# Altium schematic sheet CarMainBoard.SchDoc
size A2
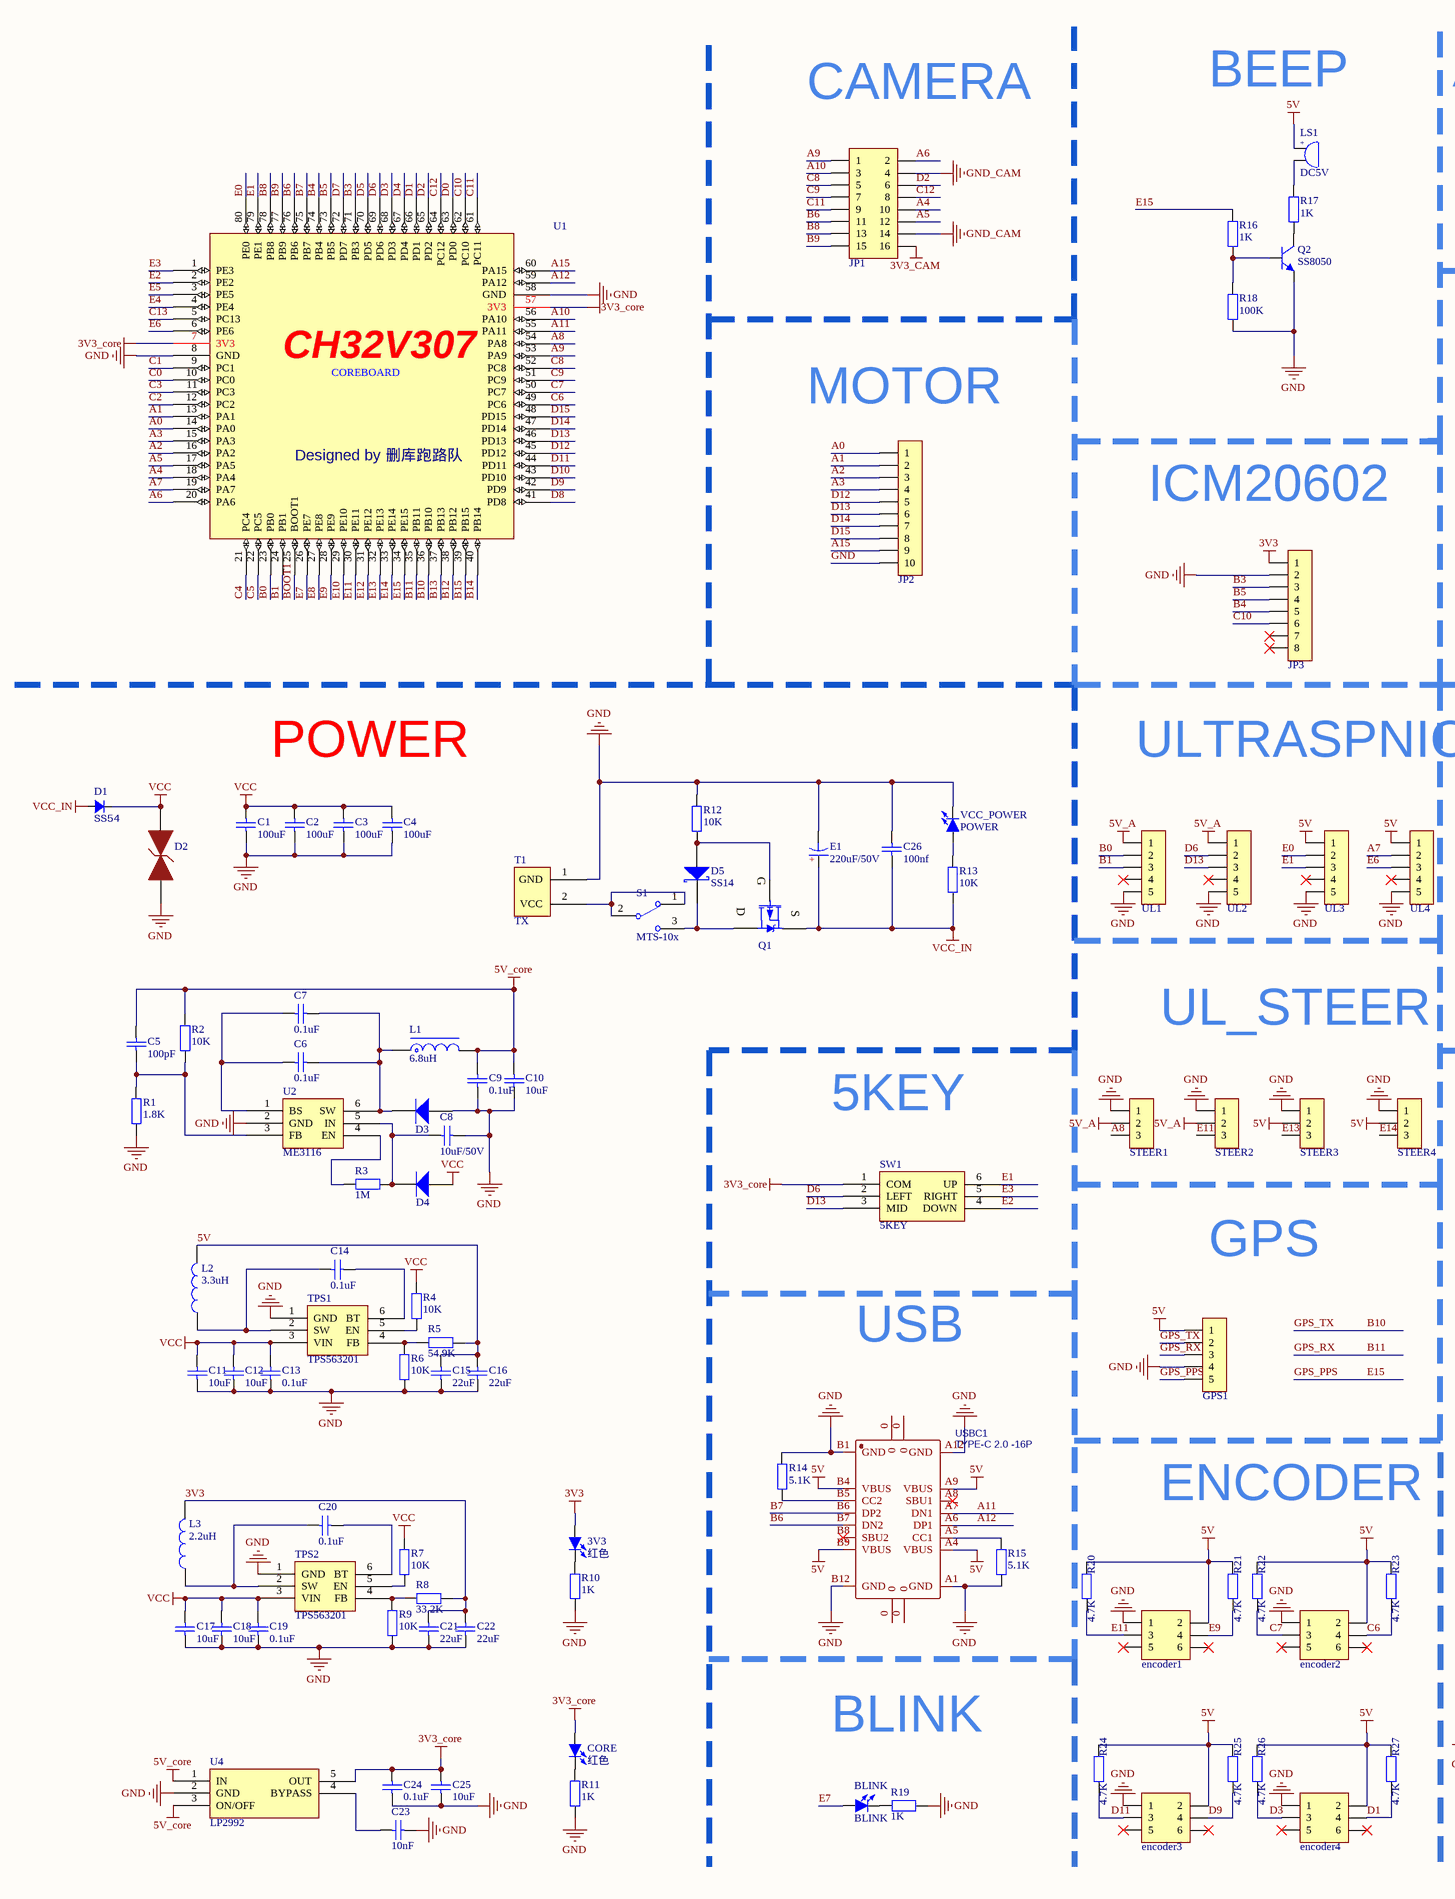
[diagram p0: CarMainBoard.SchDoc, left]
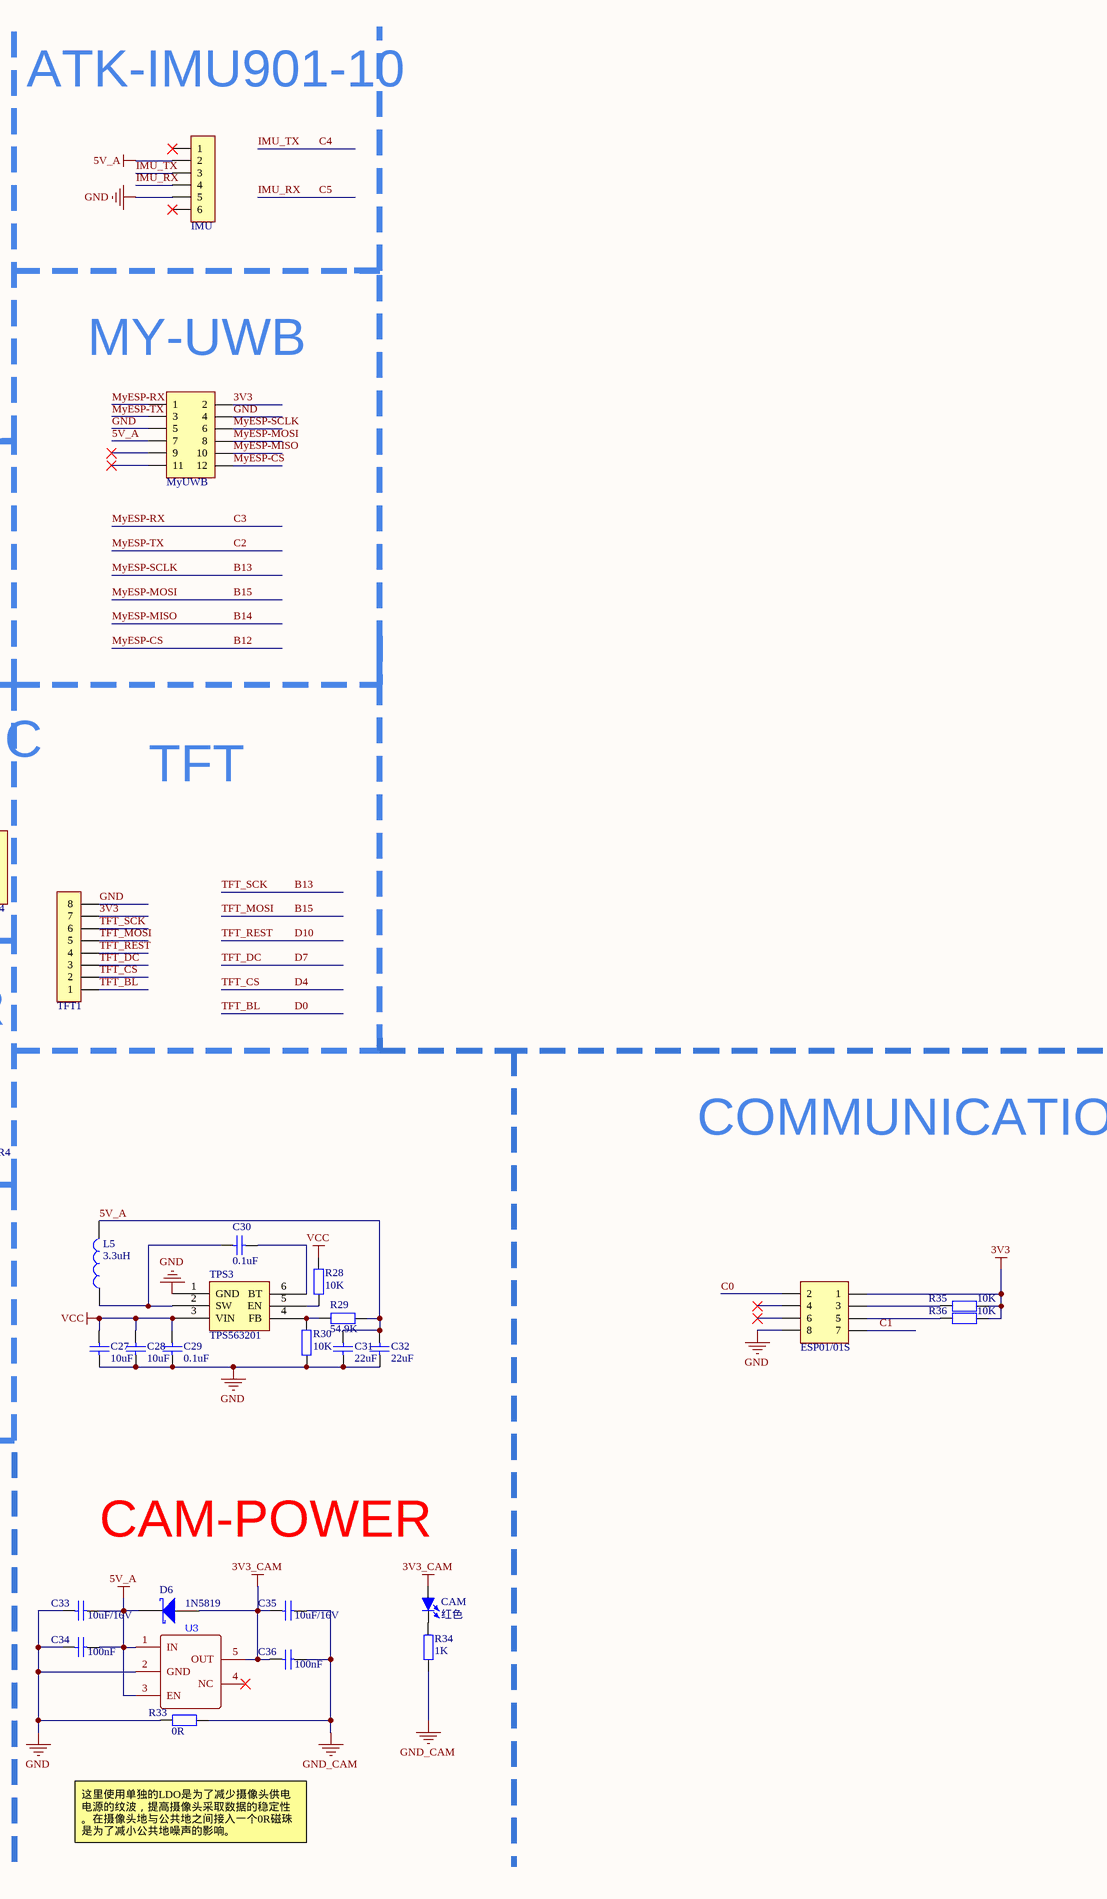
[diagram p1: CarMainBoard.SchDoc, right]

## Parts
3V3  红色  [LED0805_G]
BLINK  BLINK  [LED0805_G]
C1  100uF  [C1206_L]
C2  100uF  [C1206_L]
C3  100uF  [C1206_L]
C4  100uF  [C1206_L]
C5  100pF  [C0402_L]
C6  0.1uF  [C0402_L]
C7  0.1uF  [C0402_L]
C8  10uF/50V  [C0603_L]
C9  0.1uF  [C0402_L]
C10  10uF  [C0402_L]
C11  10uF  [C0805_L]
C12  10uF  [C0805_L]
C13  0.1uF  [C0805_L]
C14  0.1uF  [C0805_L]
C15  22uF  [C0805_L]
C16  22uF  [C0805_L]
C17  10uF  [C0805_L]
C18  10uF  [C0805_L]
C19  0.1uF  [C0805_L]
C20  0.1uF  [C0805_L]
C21  22uF  [C0805_L]
C22  22uF  [C0805_L]
C23  10nF  [C0402_L]
C24  0.1uF  [C0402_L]
C25  10uF  [C0402_L]
C26  100nf  [C0805_L]
C27  10uF  [C0805_L]
C28  10uF  [C0805_L]
C29  0.1uF  [C0805_L]
C30  0.1uF  [C0805_L]
C31  22uF  [C0805_L]
C32  22uF  [C0805_L]
C33  10uF/16V  [C0805_L]
C34  100nF  [C0805_L]
C35  10uF/16V  [C0805_L]
C36  100nF  [C0805_L]
CAM  红色  [LED0805_G]
CORE  红色  [LED0805_G]
D1  SS54  [SMA]
D2  SMBJ28CA  [SMB]  (value not drawn)
D3  二极管-5819W  [SOD-323]  (value not drawn)
D4  二极管-5819W  [SOD-323]  (value not drawn)
D5  SS14  [SMA]
D6  1N5819  [SOD-323]
E1  220uF/50V  [CE F(10*10.2)]
encoder1  Header3X2  [HDR2.54-M-LS-2x3P]  (value not drawn)
encoder2  Header3X2  [HDR2.54-M-LS-2x3P]  (value not drawn)
encoder3  Header3X2  [HDR2.54-M-LS-2x3P]  (value not drawn)
encoder4  Header3X2  [HDR2.54-M-LS-2x3P]  (value not drawn)
ESP01/01S  Header 4X2  [HDR2.54-M-LS-2x4P]  (value not drawn)
GPS1  HDR-1X5  [HDR2.54-M-LI-5P]  (value not drawn)
IMU  HDR-1X6  [HDR2.54-M-LI-6P]  (value not drawn)
JP1  Header 8X2  [HDR2.54-M-LS-2x8P]  (value not drawn)
JP2  HDR-1X10  [XH2.54-LI-10P]  (value not drawn)
JP3  HDR-1X8  [HDR2.54-M-LI-8P]  (value not drawn)
L1  6.8uH  [L-SMD-0420]
L2  3.3uH  [L-SMD-0630]
L3  2.2uH  [L-SMD-0630]
L5  3.3uH  [L-SMD-0630]
LS1  DC5V  [BEEP 5x9x5.5]
MyUWB  Header 6X2  [HDR2.54-M-LS-2x6P]  (value not drawn)
Q1  D15P05  [TO252]  (value not drawn)
Q2  SS8050  [SOT23-3N]
R1  1.8K  [R0402_L]
R2  10K  [R0402_L]
R3  1M  [R0402_L]
R4  10K  [R0603_L]
R5  54.9K  [R0603_L]
R6  10K  [R0603_L]
R7  10K  [R0603_L]
R8  33.2K  [R0603_L]
R9  10K  [R0603_L]
R10  1K  [R0402_L]
R11  1K  [R0402_L]
R12  10K  [R0805_L]
R13  10K  [R0805_L]
R14  5.1K  [R0402_L]
R15  5.1K  [R0402_L]
R16  1K  [R0402_L]
R17  1K  [R0402_L]
R18  100K  [R0402_L]
R19  1K  [R0402_L]
R20  4.7K  [R0603_L]
R21  4.7K  [R0603_L]
R22  4.7K  [R0603_L]
R23  4.7K  [R0603_L]
R24  4.7K  [R0603_L]
R25  4.7K  [R0603_L]
R26  4.7K  [R0603_L]
R27  4.7K  [R0603_L]
R28  10K  [R0603_L]
R29  54.9K  [R0603_L]
R30  10K  [R0603_L]
R33  0R  [R0805_L]
R34  1K  [R0402_L]
R35  10K  [R0402_L]
R36  10K  [R0402_L]
S1  MTS-10x  [MTS-10x]
STEER1  HDR-1X3  [HDR2.54-LI-3P]  (value not drawn)
STEER2  HDR-1X3  [HDR2.54-LI-3P]  (value not drawn)
STEER3  HDR-1X3  [HDR2.54-LI-3P]  (value not drawn)
STEER4  HDR-1X3  [HDR2.54-LI-3P]  (value not drawn)
SW1  5KEY  [SW 10x10x9-5Key-LS]
T1  TX  [T接头]
TFT1  HDR-1X8  [HDR2.54-M-LI-8P]  (value not drawn)
TPS1  TPS563201  [SOT23-6N]
TPS2  TPS563201  [SOT23-6N]
TPS3  TPS563201  [SOT23-6N]
U1  CH32V307_CoreBoard  [CH32V307_PCB]  (value not drawn)
U2  ME3116  [SOT23-6]
U3  (no value)  [SOT23-5]
U4  LP2992  [SOT23-5]
UL1  HDR-1X5  [HDR2.54-M-LI-5P]  (value not drawn)
UL2  HDR-1X5  [HDR2.54-M-LI-5P]  (value not drawn)
UL3  HDR-1X5  [HDR2.54-M-LI-5P]  (value not drawn)
UL4  HDR-1X5  [HDR2.54-M-LI-5P]  (value not drawn)
USBC1  TYPE-C 2.0 -16P  [USB-C-SMD_TYPE-C-USB-5]
VCC_POWER  POWER  [LED 0805R]

## Nets
3V3: 3V3.1(A) C21.1 C22.1 ESP01/01S.1 JP3.1 L3.2 MyUWB.2 R8.1 R35.1 R36.1 TFT1.7
3V3_CAM: C35.2 C36.2 CAM.1(A) D6.1(A) JP1.16 U3.5(OUT)
3V3_core: C24.2 C25.2 CORE.1(A) SW1.1(COM) U1.7(3V3) U1.57(3V3) U4.5(OUT)
5V: C15.1 C16.1 encoder1.2 encoder2.2 encoder3.2 encoder4.2 GPS1.1 L2.2 LS1.1 R5.1 R20.2 R21.2 R22.2 R23.2 R24.2 R25.2 R26.2 R27.2 STEER3.2 STEER4.2 UL3.1 UL4.1 USBC1.A4(VBUS) USBC1.A9(VBUS) USBC1.B4(VBUS) USBC1.B9(VBUS)
5V_A: C31.1 C32.1 C33.1 C34.1 D6.2(K) IMU.2 L5.2 MyUWB.7 R29.1 STEER1.2 STEER2.2 U3.1(IN) U3.3(EN) UL1.1 UL2.1
5V_core: C5.2 C9.1 C10.2 L1.2 R2.2 U4.1(IN) U4.3(ON/OFF)
GND: C1.1 C2.1 C3.1 C4.1 C8.1 C9.2 C10.1 C11.1 C12.1 C13.1 C15.2 C16.2 C17.1 C18.1 C19.1 C21.2 C22.2 C23.1 C24.1 C25.1 C26.2 C27.1 C28.1 C29.1 C31.2 C32.2 C33.2 C34.2 D2.1 D3.1(A) E1.2 encoder1.1 encoder2.1 encoder3.1 encoder4.1 ESP01/01S.8 GPS1.4 IMU.5 JP2.10 JP3.2 MyUWB.4 MyUWB.5 Q2.2(E) R1.1 R6.1 R9.1 R10.1 R11.1 R12.2 R14.2 R15.1 R18.1 R19.2 R30.1 R33.1 STEER1.1 STEER2.1 STEER3.1 STEER4.1 T1.1(GND) TFT1.8 TPS1.1(GND) TPS2.1(GND) TPS3.1(GND) U1.8(GND) U1.58(GND) U2.2(GND) U3.2(GND) U4.2(GND) UL1.5 UL2.5 UL3.5 UL4.5 USBC1.A1(GND) USBC1.A12(GND) USBC1.B1(GND) USBC1.B12(GND) VCC_POWER.2(K)
GND_CAM: C35.1 C36.1 JP1.4 JP1.14 R33.2 R34.1
VCC: C1.2 C2.2 C3.2 C4.2 C11.2 C12.2 C13.2 C17.2 C18.2 C19.2 C27.2 C28.2 C29.2 D1.2(K) D2.2 D4.1(A) R4.2 R7.2 R28.2 TPS1.3(VIN) TPS2.3(VIN) TPS3.3(VIN)
VCC_IN: C26.1 D1.1(A) E1.1 Q1.3(S) R13.1
A0: JP2.1 U1.14(PA0)
A1: JP2.2 U1.13(PA1)
A2: JP2.3 U1.16(PA2)
A3: JP2.4 U1.15(PA3)
A4: JP1.10 U1.18(PA4)
A5: JP1.12 U1.17(PA5)
A6: JP1.2 U1.20(PA6)
A7: U1.19(PA7) UL4.2
A8: STEER1.3 U1.54(PA8)
A9: JP1.1 U1.53(PA9)
A10: JP1.3 U1.56(PA10)
A11: U1.55(PA11) USBC1.A7(DN1)
A12: U1.59(PA12) USBC1.A6(DP1)
A15: JP2.9 U1.60(PA15)
B0: U1.23(PB0) UL1.2
B1: U1.24(PB1) UL1.3
B3: JP3.3 U1.71(PB3)
B4: JP3.5 U1.74(PB4)
B5: JP3.4 U1.73(PB5)
B6: JP1.11 U1.76(PB6) USBC1.B7(DN2)
B7: U1.75(PB7) USBC1.B6(DP2)
B8: JP1.13 U1.78(PB8)
B9: JP1.15 U1.77(PB9)
B10: GPS1.2 U1.36(PB10)  [also labelled GPS_TX]
B11: GPS1.3 U1.35(PB11)  [also labelled GPS_RX]
B12: MyUWB.12 U1.38(PB12)  [also labelled MyESP-CS]
B13: MyUWB.6 TFT1.6 U1.37(PB13)  [also labelled MyESP-SCLK, TFT_SCK]
B14: MyUWB.10 U1.40(PB14)  [also labelled MyESP-MISO]
B15: MyUWB.8 TFT1.5 U1.39(PB15)  [also labelled MyESP-MOSI, TFT_MOSI]
BOOT1: U1.25(BOOT1)
C0: ESP01/01S.2 U1.10(PC0)
C1: ESP01/01S.7 U1.9(PC1)
C2: MyUWB.3 U1.12(PC2)  [also labelled MyESP-TX]
C3: MyUWB.1 U1.11(PC3)  [also labelled MyESP-RX]
C4: IMU.3 U1.21(PC4)  [also labelled IMU_TX]
C5: IMU.4 U1.22(PC5)  [also labelled IMU_RX]
C6: encoder2.4 R23.1 U1.49(PC6)
C7: encoder2.3 R22.1 U1.50(PC7)
C8: JP1.5 U1.52(PC8)
C9: JP1.7 U1.51(PC9)
C10: JP3.6 U1.62(PC10)
C11: JP1.9 U1.61(PC11)
C12: JP1.8 U1.64(PC12)
C13: U1.5(PC13)
D0: TFT1.1 U1.63(PD0)  [also labelled TFT_BL]
D1: encoder4.4 R27.1 U1.66(PD1)
D2: JP1.6 U1.65(PD2)
D3: encoder4.3 R26.1 U1.68(PD3)
D4: TFT1.2 U1.67(PD4)  [also labelled TFT_CS]
D5: U1.70(PD5)
D6: SW1.2(LEFT) U1.69(PD6) UL2.2
D7: TFT1.3 U1.72(PD7)  [also labelled TFT_DC]
D8: U1.41(PD8)
D9: encoder3.4 R25.1 U1.42(PD9)
D10: TFT1.4 U1.43(PD10)  [also labelled TFT_REST]
D11: encoder3.3 R24.1 U1.44(PD11)
D12: JP2.5 U1.45(PD12)
D13: JP2.6 SW1.3(MID) U1.46(PD13) UL2.3
D14: JP2.7 U1.47(PD14)
D15: JP2.8 U1.48(PD15)
E0: U1.80(PE0) UL3.2
E1: SW1.6(UP) U1.79(PE1) UL3.3
E2: SW1.4(DOWN) U1.2(PE2)
E3: SW1.5(RIGHT) U1.1(PE3)
E4: U1.4(PE4)
E5: U1.3(PE5)
E6: U1.6(PE6) UL4.3
E7: BLINK.1(A) U1.26(PE7)
E8: U1.27(PE8)
E9: encoder1.4 R21.1 U1.28(PE9)
E10: U1.29(PE10)
E11: encoder1.3 R20.1 STEER2.3 U1.30(PE11)
E12: U1.31(PE12)
E13: STEER3.3 U1.32(PE13)
E14: STEER4.3 U1.33(PE14)
E15: GPS1.5 R16.1 U1.34(PE15)  [also labelled GPS_PPS]
Net3V3_2: 3V3.2(K) R10.2
NetBLINK_2: BLINK.2(K) R19.1
NetC5_1: C5.1 R1.2 R2.1 U2.3(FB)
NetC6_1: C6.1 C7.1 D3.2(K) L1.1 U2.6(SW)
NetC6_2: C6.2 C7.2 U2.1(BS)
NetC8_2: C8.2 D4.2(K) R3.2 U2.5(IN)
NetC14_1: C14.1 L2.1 TPS1.2(SW)
NetC14_2: C14.2 TPS1.6(BT)
NetC20_1: C20.1 L3.1 TPS2.2(SW)
NetC20_2: C20.2 TPS2.6(BT)
NetC23_2: C23.2 U4.4(BYPASS)
NetC30_1: C30.1 L5.1 TPS3.2(SW)
NetC30_2: C30.2 TPS3.6(BT)
NetCAM_2: CAM.2(K) R34.2
NetCORE_2: CORE.2(K) R11.2
NetD5_1: D5.1(A) Q1.1(G) R12.1
NetD5_2: D5.2(K) Q1.2(D) S1.3
NetESP01/01S_3: ESP01/01S.3 R35.2
NetESP01/01S_5: ESP01/01S.5 R36.2
NetLS1_2: LS1.2 R17.2
NetQ2_1: Q2.1(B) R16.2 R18.2
NetQ2_3: Q2.3(C) R17.1
NetR3_1: R3.1 U2.4(EN)
NetR4_1: R4.1 TPS1.5(EN)
NetR5_2: R5.2 R6.2 TPS1.4(FB)
NetR7_1: R7.1 TPS2.5(EN)
NetR8_2: R8.2 R9.2 TPS2.4(FB)
NetR13_2: R13.2 VCC_POWER.1(A)
NetR14_1: R14.1 USBC1.B5(CC2)
NetR15_2: R15.2 USBC1.A5(CC1)
NetR28_1: R28.1 TPS3.5(EN)
NetR29_2: R29.2 R30.2 TPS3.4(FB)
NetS1_1: S1.1 S1.2 T1.2(VCC)

Not connected (* = marked no-connect by the designer): encoder1 5* 6*; encoder2 5* 6*; encoder3 5* 6*; encoder4 5* 6*; ESP01/01S 4* 6*; IMU 1* 6*; JP3 7* 8*; MyUWB 9* 11*; U3 4(NC)*; UL1 4*; UL2 4*; UL3 4*; UL4 4*; USBC1 0 A8(SBU1)* B8(SBU2)*

## Notes on the sheet
- BEEP
- ATK-IMU901-10
- CAMERA
- (near MyUWB) MY-UWB
- (near JP2) MOTOR
- ICM20602
- POWER
- ULTRASPNIC
- TFT
- UL_STEER
- 5KEY
- COMMUNICATION
- GPS
- USB
- ENCODER
- CAM-POWER
- BLINK
- 这里使用单独的LDO是为了减少摄像头供电电源的纹波，提高摄像头采取数据的稳定性。在摄像头地与公共地之间接入一个0R磁珠是为了减小公共地噪声的影响。
- Title
- Size:
- Date:
- File:
- A2
- Number:
- Time:
- Revision:
- Sheet
- of
- (in symbol BEEP) +
- (in symbol CE_SMD) +
- (in symbol CH32V307_CoreBoard) CH32V307; COREBOARD; Designed by 删库跑路队

## Library data of the parts
3V3 BLINK CAM CORE = LED-SMD: 贴片LED; 封装库来自淘宝卖家ID：黄晶宝石: 其他店铺购入均为盗版封装库，请立即申请退款，本店现金奖励20~200元; BOM名称: 贴片LED
C1-C7 C9-C36 = C: 贴片电容/MLCC电容; BOM名称: 无极性贴片电容; 联系卖家，免费查找封装: 唯一出售店铺网址https://shop463601444.taobao.com
C8 = C: 陶瓷电容; BOM名称: 无极性贴片电容; 联系卖家，免费查找封装: 唯一出售店铺网址https://shop463601444.taobao.com
D1 = Diode_SMA: Diode; Value: SS54; Type: SMA
D3 D4 = 二极管-5819W: 40V
D5 D6 = SS14: 肖特基二极管; 属性: 40V/1A; 以赠品形式获赠本封装库的买家，还可联系卖家免费指导AD软件使用: 封装库来自淘宝卖家ID：黄晶宝石; BOM名称: 肖特基二极管
E1 = CE_SMD: 贴片电解电容; 联系卖家，免费查找封装: 唯一出售店铺网址https://shop463601444.taobao.com; BOM名称: 贴片电解电容
encoder1-encoder4 = Header 3X2: 3*2P接插件; 联系卖家，免费查找封装: 唯一出售店铺网址https://shop463601444.taobao.com; 封装库来自淘宝卖家ID:黄晶宝石: 其他店铺购入均为盗版假冒封装库，请立即申请退款，本店现金奖励20~200元; BOM名称: 3*2P接插件
ESP01/01S = Header 4X2: 4*2P接插件; 版权归属: 封装库来自淘宝 ID：黄晶宝石; BOM名称: 4*2P接插件; 学习资源: https://shop463601444.taobao.com
GPS1 UL1-UL4 = Header 5: 5P接插件; 联系卖家，免费查找封装: 唯一出售店铺网址https://shop463601444.taobao.com; 封装库来自淘宝卖家ID:黄晶宝石: 其他店铺购入均为盗版假冒封装库，请立即申请退款，本店现金奖励20~200元; BOM名称: 5P接插件
IMU = Header 6: 6P接插件; 联系卖家，免费查找封装: 唯一出售店铺网址https://shop463601444.taobao.com; 封装库来自淘宝卖家ID:黄晶宝石: 其他店铺购入均为盗版假冒封装库，请立即申请退款，本店现金奖励20~200元; BOM名称: 6P接插件
JP1 = Header 8X2: 8*2P接插件; 联系卖家，免费查找封装: 唯一出售店铺网址https://shop463601444.taobao.com; 封装库来自淘宝卖家ID:黄晶宝石: 其他店铺购入均为盗版假冒封装库，请立即申请退款，本店现金奖励20~200元; BOM名称: 8*2P接插件
JP2 = Header 10: 10P接插件; 联系卖家，免费查找封装: 唯一出售店铺网址https://shop463601444.taobao.com; 封装库来自淘宝卖家ID:黄晶宝石: 其他店铺购入均为盗版假冒封装库，请立即申请退款，本店现金奖励20~200元; BOM名称: 10P接插件
JP3 TFT1 = Header 8: 8P接插件; 联系卖家，免费查找封装: 唯一出售店铺网址https://shop463601444.taobao.com; 封装库来自淘宝卖家ID:黄晶宝石: 其他店铺购入均为盗版假冒封装库，请立即申请退款，本店现金奖励20~200元; BOM名称: 8P接插件
L1 = L-Molding Choke: 一体成型电感; 联系卖家，免费查找封装: 唯一出售店铺网址https://shop463601444.taobao.com; BOM名称: 一体成型电感
L2 L3 L5 = L: 贴片小功率电感; BOM名称: 小功率贴片电感; 联系卖家，免费查找封装: 唯一出售店铺网址https://shop463601444.taobao.com
LS1 = BEEP: 蜂鸣器; 联系卖家，免费查找封装: 唯一出售店铺网址https://shop463601444.taobao.com; 封装库来自淘宝卖家ID：黄晶宝石: 其他店铺购入的，请立即申请退款，本店现金奖励20~500元; BOM名称: 蜂鸣器
MyUWB = Header  6X2: 6*2P接插件; 版权归属: 封装库来自淘宝 ID：黄晶宝石; BOM名称: 6*2P接插件; 学习资源: https://shop463601444.taobao.com
Q1 = D15P05: P沟道 50V/15A; BOM名称: P沟道场效应管; 以赠品形式获赠 本封装库的买家: 还可以联系卖家远程指导AD软件使用
Q2 = 8050-SMD: 高频放大-NPN型; 参数: 40V 1.5A 1W 100MHZ; 以赠品形式获赠 本封装库的买家: 还可以联系卖家远程指导AD软件使用; BOM名称: 高频放大-NPN型
R1-R30 R33-R36 = R: 贴片电阻; 联系卖家，免费查找封装: 唯一出售店铺网址https://shop463601444.taobao.com; BOM名称: 贴片电阻
S1 = MTS-10x: MTS10x系列3脚扭子开关; 联系卖家，免费查找封装: 唯一出售店铺网址https://shop463601444.taobao.com; 封装库来自淘宝卖家ID：黄晶宝石: 其他店铺购入的，请立即申请退款，本店现金奖励20~500元; BOM名称: MTS10x系列3脚扭子开关
STEER1-STEER4 = Header 3: 3P接插件; 联系卖家，免费查找封装: 唯一出售店铺网址https://shop463601444.taobao.com; 封装库来自淘宝卖家ID:黄晶宝石: 其他店铺购入均为盗版假冒封装库，请立即申请退款，本店现金奖励20~200元; BOM名称: 3P接插件
SW1 = five_key
T1 = T接头
TPS1-TPS3 = tps
U3 = RT9013-33
USBC1 = USB2.0 Type-C 16Pin母座: USB2.0 Type-C 母座 16Pin; BOM_Manufacturer: LCSC; BOM_Supplier: LCSC; BOM_Manufacturer Part: -; spicePre: U; spiceSymbolName: TYPE-C 3.1 -16P_C168689
VCC_POWER = LED-SMD: 贴片LED; 版权归属: 封装库来自淘宝 ID：黄晶宝石; BOM名称: 贴片LED; 学习资源: https://shop463601444.taobao.com